# Altium project BC.v.2.PrjPcb
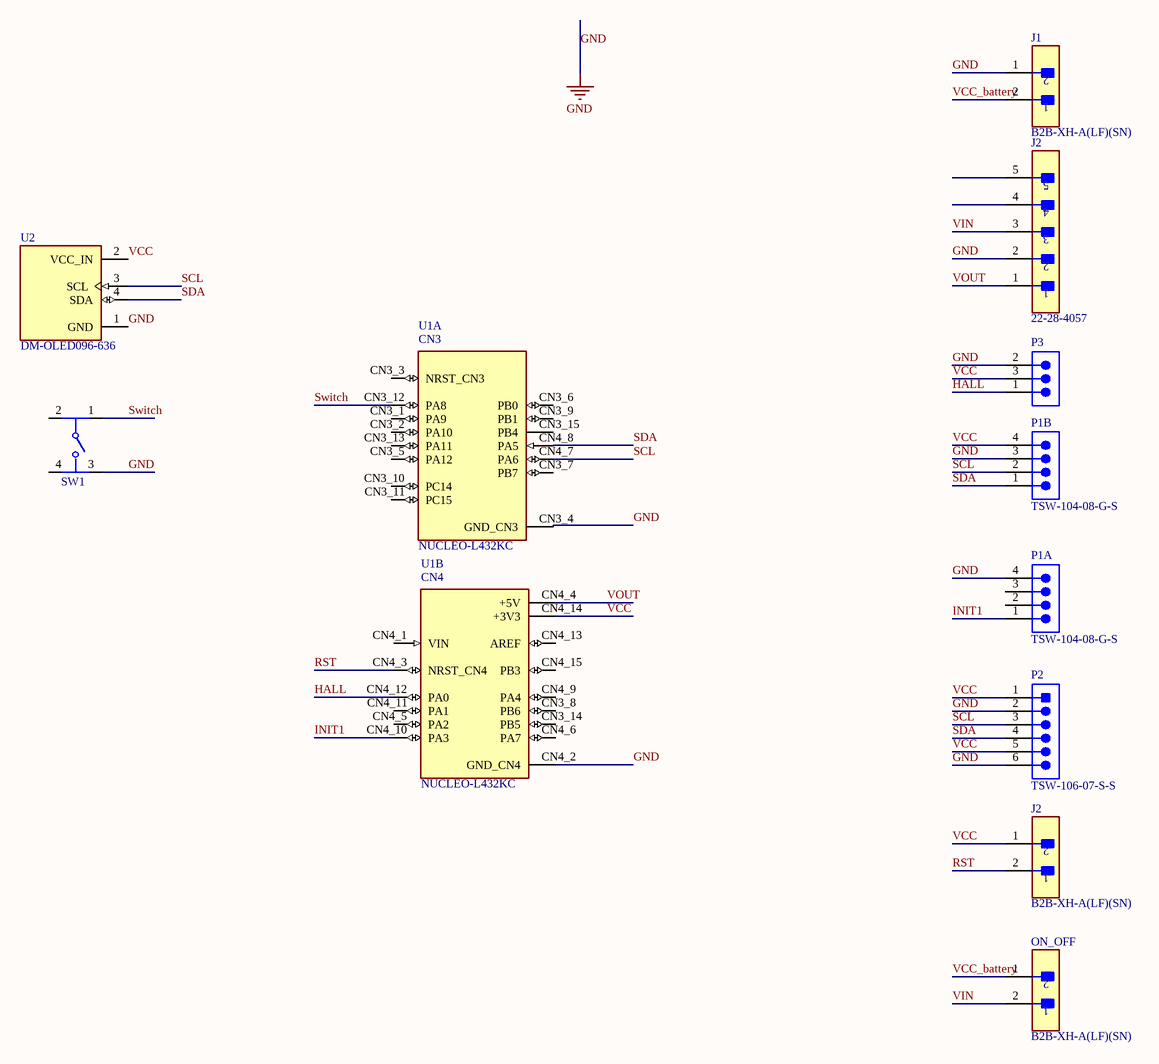
[diagram p0: BC.v.1.SchDoc]
1 sheet, 11 parts. Net scope: global (net labels, ports and power ports of the same name join across sheets).
Board file: PCB1.PcbDoc

## Sheet BC.v.1.SchDoc
size A0; SheetNumber: 1; SheetTotal: 1

### Parts
(Parts that share a designator on the sheet are numbered #1, #2 ... from top to bottom, then left to right.)
J1  B2B-XH-A(LF)(SN)  [FP-B2B-XH-A_LF_SN-MFG]
J2#1  22-28-4057  [FP-22-28-4057-MFG]
J2#2  B2B-XH-A(LF)(SN)  [FP-B2B-XH-A_LF_SN-MFG]
ON_OFF  B2B-XH-A(LF)(SN)  [FP-B2B-XH-A_LF_SN-MFG]
P1A  TSW-104-08-G-S  [SMTC-TSW-104-08-X-S]
P1B  TSW-104-08-G-S  [SMTC-TSW-104-08-X-S]
P2  TSW-106-07-S-S  [SMTC-TSW-106-07-S-S_V]
P3  TSW-103-07-G-S  [SMTC-TSW-103-07-X-S]  (value not drawn)
SW1  2-1977223-2  [FP-2-1977223-2-MFG]  (value not drawn)
U1  NUCLEO-L432KC  [MODULE_NUCLEO-L432KC]  (parts A,B of 2)
U2  DM-OLED096-636  [MODULE_DM-OLED096-636]

### Nets
GND: J1.1 J2#1.2 P1A.4 P1B.3 P2.2 P2.6 P3.2 SW1.3 U1.CN3_4(GND_CN3) U1.CN4_2(GND_CN4) U2.1(GND)
HALL: P3.1 U1.CN4_12(PA0)
INIT1: P1A.1 U1.CN4_10(PA3)
RST: J2#2.2 U1.CN4_3(NRST_CN4)
SCL: P1B.2 P2.3 U1.CN4_7(PA6) U2.3(SCL)
SDA: P1B.1 P2.4 U1.CN4_8(PA5) U2.4(SDA)
Switch: SW1.1 U1.CN3_12(PA8)
VCC: J2#2.1 P1B.4 P2.1 P2.5 P3.3 U1.CN4_14(+3V3) U2.2(VCC_IN)
VCC_battery: J1.2 ON_OFF.1
VIN: J2#1.3 ON_OFF.2
VOUT: J2#1.1 U1.CN4_4(+5V)

Not connected (* = marked no-connect by the designer): J2#1 4 5; P1A 2 3; SW1 2 4; U1 CN3_1(PA9) CN3_2(PA10) CN3_3(NRST_CN3) CN3_5(PA12) CN3_6(PB0) CN3_7(PB7) CN3_8(PB6) CN3_9(PB1) CN3_10(PC14) CN3_11(PC15) CN3_13(PA11) CN3_14(PB5) CN3_15(PB4) CN4_1(VIN) CN4_5(PA2) CN4_6(PA7) CN4_9(PA4) CN4_11(PA1) CN4_13(AREF) CN4_15(PB3)

### Notes on the sheet
- (in symbol CMP-036-000000-1, part A) CN3
- (in symbol CMP-036-000000-1, part B) CN4

### Library data of the parts
J1 J2#2 ON_OFF = CMP-2000-05888-3: CONN HEADER VERT 2POS 2.5MM; Current Rating: 3A; Voltage Rating: 250V; Number of Contacts: 2; Contact Resistance: 20mR; Wire/Cable Gauge: 22AWG; Insulation Resistance: 1GR; Connector Type: Male Pin; Packaging: Bulk; Contact Material: Brass; Lead Free: Lead Free; Orientation: Straight; Contact Plating: Tin; Max Current Rating: 3A; Termination: Solder; Fastening Type: Detent; Depth: 5.75mm; Housing Material: Polyamide; REACH SVHC: No SVHC; Series: XH; Voltage Rating (AC): 250V; Number of Positions: 2; Color: Natural; Contact Type: Male Pin; Max Voltage Rating (DC): 250V; Pitch: 2.5mm; Lead Pitch: 2.5mm; Mount: Through Hole; Max Operating Temperature: 85°C; Length: 7.4mm; Max Voltage Rating (AC): 250V; Min Operating Temperature: -25°C; Number of Rows: 1; Housing Color: White
J2#1 = CMP-04776-001007-1: KK 100 HDR ASSY BKWY 05 CKT 30 S; Connector Type: Male Pin; Number of Contacts: 5; Glow Wire Compliant: Non-compliant; Gender: Male; Max Voltage Rating (DC): 250.25kV; Pitch: 2.54mm; Current Rating: 4A; Voltage Rating: 250V; Contact Resistance: 20mR; Min Operating Temperature: 0°C; Mount: Through Hole; Lead Free: Lead Free; Housing Color: Black; Max Operating Temperature: 75°C; Color: Black; Number of Rows: 1; Number of Circuits: 5; Contact Material: Brass; Packaging: Bulk; Contact Plating: Gold; Package Quantity: 1; Orientation: Straight; RoHS Compliant: Yes; Contact Type: Male Pin; Termination: Solder; Contact Mating Length: 0.32inch; Series: 42375; Number of Positions: 5; Housing Material: Thermoplastic
P1A P1B = CMP-1024-00357-1: 0.025" SQ Post Header, Through-hole, Vertical, -55 to 125 degC, 2.54 mm Pitch, 4-Pin, Male, RoHS; Manufacturer: Samtec; Pitch: 2.54 mm; RoHS: True; ComponentLink3URL: http://www.samtec.com/documents/webfiles/cpdf/TSW-XXX-XX-XXX-X-XX-XXX-MKT.pdf; Mounting Technology: Through-hole; ComponentLink2URL: http://www.samtec.com/documents/webfiles/pdf/TSW_TH.PDF; ComponentLink1URL: http://www.samtec.com; ComponentLink3Description: Package Specification; PackageVersion: DM, 8/1988; ComponentLink2Description: Datasheet; PackageReference: TSW-104-08-X-S; PackageDescription: .025[0.64] SQ. Post Terminal Strip Assembly; PartNumber: TSW-104-08-G-S; ComponentLink1Description: Manufacturer URL; Temperature Range: -55 to 125 degC; DatasheetVersion: F-214; Orientation: Vertical
P2 = CMP-1681-00007-2: Male Header, Pitch 2.54 mm, 1 x 6 Position, Height 8.38 mm, Tail Length 2.54 mm, -55 to 125 degC, RoHS, Bulk; Manufacturer: Samtec; Rows: 1; Contact Finish: Gold; Lead Pitch: 0.1 inch; Package Quantity: 1; Mounting Technology: Through Hole; ComponentLink1Description: Manufacturer URL; Contact Plating: Gold; DatasheetVersion: 12/2015; ComponentLink3Description: Package Specification; PackageDescription: Male Header, Pitch 2.54 mm, 1 x 6 Position, Height 8.38 mm, Tail Length 2.54 mm; Height: 8.38 mm; ComponentLink2Description: Datasheet; RoHSCompliant: true; Colour: Black; Packaging: Bulk; Min Operating Temperature: -55 degC; ComponentLink2URL: http://suddendocs.samtec.com/catalog_english/tsw_th.pdf; Mount: Through Hole; PackageReference: TSW-102-07-S-S; Pins: 6; Max Operating Temperature: 125 degC; ComponentLink3URL: http://suddendocs.samtec.com/prints/tsw-xxx-xx-x-x-xx-xxx-footprint.pdf; Length: 15.24 mm; Contact Material: Bronze; ComponentLink1URL: http://www.samtec.com/
P3 = CMP-1024-00333-1: 0.025" SQ Post Header, Through-hole, Vertical, -55 to 125 degC, 2.54 mm Pitch, 3-Pin, Male, RoHS; Manufacturer: Samtec; Pitch: 2.54 mm; ComponentLink3URL: http://www.samtec.com/documents/webfiles/cpdf/TSW-XXX-XX-XXX-X-XX-XXX-MKT.pdf; Temperature Range: -55 to 125 degC; DatasheetVersion: F-214; ComponentLink1Description: Manufacturer URL; ComponentLink2URL: http://www.samtec.com/documents/webfiles/pdf/TSW_TH.PDF; RoHS: True; Orientation: Vertical; ComponentLink2Description: Datasheet; ComponentLink3Description: Package Specification; PackageDescription: .025[0.64] SQ. Post Terminal Strip Assembly; Mounting Technology: Through-hole; PackageVersion: DM, 8/1988; ComponentLink1URL: http://www.samtec.com; PackageReference: TSW-103-07-X-S; PartNumber: TSW-103-07-G-S
SW1 = CMP-03407-000026-1: SWITCH TACTILE SPST-NO 0.05A 24V; RoHS Compliant: Yes
U1 = CMP-036-000000-1: STM32L432KC, mbed-Enabled Development Nucleo-32 STM32L4 ARMÂ® CortexÂ®-M4 MCU 32-Bit Embedded Evaluation Board; MF: STMicroelectronics; SnapEDA_Link: https://www.snapeda.com/parts/NUCLEO-L432KC/STMicroelectronics/view-part/?ref=snap; Value: *; Pin Count: 30; Component Type: Standard; Package: None; Source: NUCLEO-L432KC.SchLib; MP: NUCLEO-L432KC; Design Item ID: NUCLEO-L432KC; Check_prices: https://www.snapeda.com/parts/NUCLEO-L432KC/STMicroelectronics/view-part/?ref=eda
U2 = CMP-038-000001-1: 0.96â€ť 128 X 64 MONOCHROME GRAPHIC OLED DISPLAY MODULE - I2C; Value: *; Pin Count: 4; Design Item ID: DM-OLED096-636; Source: DM-OLED096-636.SchLib; MF: Display Module; SnapEDA_Link: https://www.snapeda.com/parts/DM-OLED096-636/Display+Module/view-part/?ref=snap; Package: Package; MP: DM-OLED096-636; Check_prices: https://www.snapeda.com/parts/DM-OLED096-636/Display+Module/view-part/?ref=eda; Component Type: Standard